# EAGLE design final v3 (EAGLE 7.7.0)
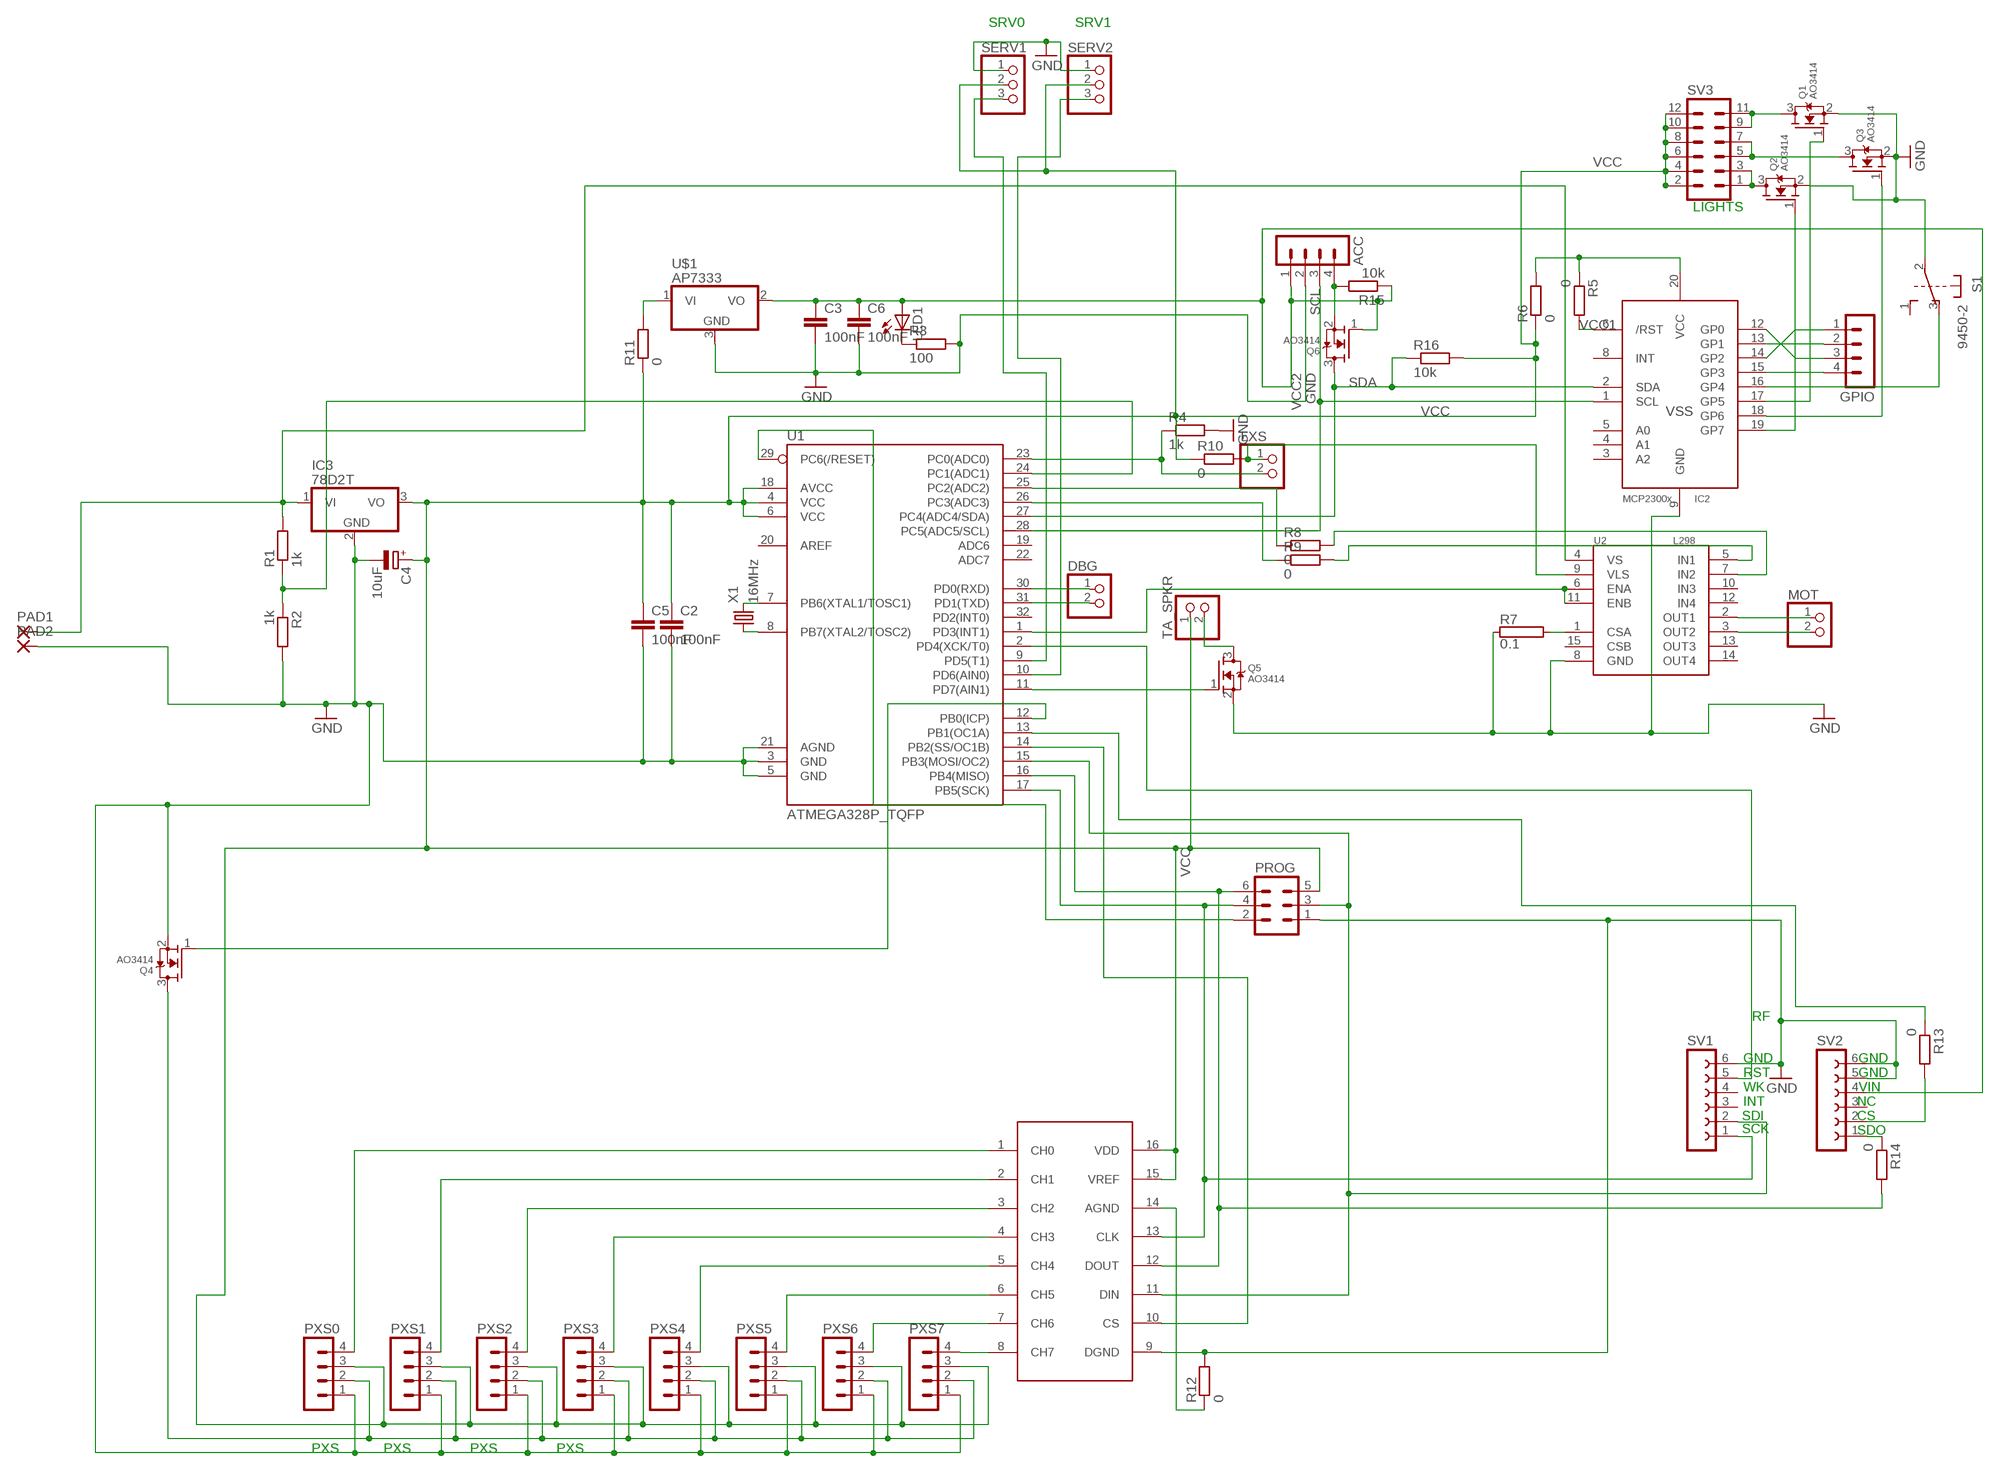
[diagram p0: schematic, sheet 1]

## Parts
ACC  MA04-1  [MA04-1]
C2  100nF  C-EUC1206  [C1206]
C3  100nF  C-EUC1206  [C1206]
C4  10uF  CPOL-EU153CLV-0505  [153CLV-0505]
C5  100nF  C-EUC1206  [C1206]
C6  100nF  C-EUC1206  [C1206]
DBG  PINHD-1X2  [1X02]
GPIO  MA04-1  [MA04-1]
IC2  MCP23008/SS  [SSOP20]
IC3  78D2T  [D2PACK]
LED1  LEDCHIPLED_0603  [CHIPLED_0603]
LXS  PINHD-1X2  [1X02]
MOT  PINHD-1X2  [1X02]
PAD1  SMD5  [SMD2,54-5,08]
PAD2  SMD5  [SMD2,54-5,08]
PROG  MA03-2  [MA03-2]
PXS0  MA04-1  [MA04-1]
PXS1  MA04-1  [MA04-1]
PXS2  MA04-1  [MA04-1]
PXS3  MA04-1  [MA04-1]
PXS4  MA04-1  [MA04-1]
PXS5  MA04-1  [MA04-1]
PXS6  MA04-1  [MA04-1]
PXS7  MA04-1  [MA04-1]
Q1  AO3414  MOSFET-NREFLOW  [SOT23]
Q2  AO3414  MOSFET-NREFLOW  [SOT23]
Q3  AO3414  MOSFET-NREFLOW  [SOT23]
Q4  AO3414  MOSFET-NREFLOW  [SOT23]
Q5  AO3414  MOSFET-NREFLOW  [SOT23]
Q6  AO3414  MOSFET-NREFLOW  [SOT23]
R1  1k  R-EU_M1206  [M1206]
R2  1k  R-EU_R1206  [R1206]
R3  100  R-EU_R0603  [R0603]
R4  1k  R-EU_M1206  [M1206]
R5  0  R-EU_R0805BR  [R0805BR]
R6  0  R-EU_R0805BR  [R0805BR]
R7  0.1  RKH208-8R  [KH208R-8]
R8  0  R-EU_R0805BR  [R0805BR]
R9  0  R-EU_R0805BR  [R0805BR]
R10  0  R-EU_R0805BR  [R0805BR]
R11  0  R-EU_R0805BR  [R0805BR]
R12  0  R-EU_R0805BR  [R0805BR]
R13  0  R-EU_R0805BR  [R0805BR]
R14  0  R-EU_R0805BR  [R0805BR]
R15  10k  R-EU_R0805BR  [R0805BR]
R16  10k  R-EU_R0805BR  [R0805BR]
S1  9450-2  [9450-2]
SERV1  PINHD-1X3  [1X03]
SERV2  PINHD-1X3  [1X03]
SV1  FE06-1  [FE06]
SV2  FE06-1  [FE06]
SV3  MA06-2  [MA06-2]
TA_SPKR  PINHD-1X2  [1X02]
U1  ATMEGA328P_TQFP  [TQFP32-08]
U2  L298  [MULTIWATT15]
U$1  AP7333  [SOT23]
U$3  MCP3208  [SO-16]
X1  16MHz  CRYSTALHC49S  [HC49/S]

## Nets
!RST: PROG.2 U1.29(PC6(/RESET))
GND: ACC.2 C2.2 C3.2 C4.- C5.2 C6.2 IC2.9(GND) IC3.2(GND) PAD2.1(P) PROG.1 PXS0.1 PXS1.1 PXS2.1 PXS3.1 PXS4.1 PXS5.1 PXS6.1 PXS7.1 Q1.2(S) Q2.2(S) Q3.2(S) Q4.2(S) Q5.2(S) R2.2 R3.2 R4.2 R7.1 R12.2 S1.2(1:P) SERV1.1 SERV2.1 SV1.6 SV2.5 SV2.6 U1.3(GND) U1.5(GND) U1.21(AGND) U2.8(GND) U$1.3(GND) U$3.9(DGND)
M_EN: U1.1(PD3(INT1)) U2.6(ENA) U2.11(ENB)
M_IN1: R8.2 U2.7(IN2)
M_IN2: R9.1 U1.26(PC3(ADC3))
MISO: PROG.6 R14.2 U1.16(PB4(MISO)) U$3.12(DOUT)
MOSI: PROG.3 SV1.2 U1.15(PB3(MOSI/OC2)) U$3.11(DIN)
N$1: Q5.1(G) U1.11(PD7(AIN1))
N$2: Q5.3(D) TA_SPKR.2
N$3: U1.14(PB2(SS/OC1B)) U$3.10(CS)
N$4: Q1.3(D) SV3.9 SV3.11
N$5: DBG.1 U1.30(PD0(RXD))
N$6: PXS7.4 U$3.8(CH7)
N$7: MOT.1 U2.2(OUT1)
N$8: PXS6.4 U$3.7(CH6)
N$9: PXS5.4 U$3.6(CH5)
N$10: DBG.2 U1.31(PD1(TXD))
N$11: PXS4.4 U$3.5(CH4)
N$12: PXS3.4 U$3.4(CH3)
N$13: PXS2.4 U$3.3(CH2)
N$14: PXS1.4 U$3.2(CH1)
N$15: Q3.3(D) SV3.5 SV3.7
N$16: PXS0.4 U$3.1(CH0)
N$17: Q2.3(D) SV3.1 SV3.3
N$18: LXS.2 R4.1 U1.23(PC0(ADC0))
N$19: Q4.1(G) U1.12(PB0(ICP))
N$20: PXS0.2 PXS1.2 PXS2.2 PXS3.2 PXS4.2 PXS5.2 PXS6.2 PXS7.2 Q4.3(D)
N$21: ACC.4 Q6.2(S) R15.2
N$22: MOT.2 U2.3(OUT2)
N$23: LED1.C R3.1
N$24: R8.1 U1.25(PC2(ADC2))
N$25: R9.2 U2.5(IN1)
N$26: SV1.5 U1.2(PD4(XCK/T0))
N$30: IC2.20(VCC) R5.1 R6.2
N$31: SERV1.3 U1.9(PD5(T1))
N$32: U1.7(PB6(XTAL1/TOSC1)) X1.2
N$33: IC2.19(GP7) Q2.1(G)
N$34: SERV2.3 U1.10(PD6(AIN0))
N$35: IC2.17(GP5) Q1.1(G)
N$36: IC2.18(GP6) Q3.1(G)
N$37: U1.8(PB7(XTAL2/TOSC2)) X1.1
N$38: R7.2 U2.1(CSA)
N$39: IC2.16(GP4) S1.3(1:O)
N$40: GPIO.3 IC2.12(GP0)
N$41: GPIO.2 IC2.13(GP1)
N$42: GPIO.1 IC2.14(GP2)
N$43: GPIO.4 IC2.15(GP3)
N$45: R11.2 U$1.1(VI)
N$46: R12.1 U$3.14(AGND)
N$47: R14.1 SV2.1
N$48: R13.2 SV2.2
RF_CS: R13.1 U1.13(PB1(OC1A))
SCK: PROG.4 SV1.1 U1.17(PB5(SCK)) U$3.13(CLK)
SCL: ACC.3 IC2.1(SCL) U1.28(PC5(ADC5/SCL))
SDA: IC2.2(SDA) Q6.3(D) R16.1 U1.27(PC4(ADC4/SDA))
VBATT: R1.1 R2.1 U1.24(PC1(ADC1))
VCC: C2.1 C4.+ C5.1 IC3.3(VO) PROG.5 PXS0.3 PXS1.3 PXS2.3 PXS3.3 PXS4.3 PXS5.3 PXS6.3 PXS7.3 R6.1 R10.1 R11.1 R16.2 SERV1.2 SERV2.2 SV3.2 SV3.4 SV3.6 SV3.8 SV3.10 SV3.12 TA_SPKR.1 U1.4(VCC) U1.6(VCC) U1.18(AVCC) U$3.15(VREF) U$3.16(VDD)
VCC0: LXS.1 R10.2 U2.9(VLS)
VCC1: IC2.6(/RST) R5.2
VCC2: ACC.1 C3.1 C6.1 LED1.A Q6.1(G) R15.1 SV2.4 U$1.2(VO)
VSS: IC3.1(VI) PAD1.1(P) R1.2 U2.4(VS)
Unconnected: IC2.3(A2) IC2.4(A1) IC2.5(A0) IC2.8(INT) S1.1(1:S) S1.4(2:S) S1.5(2:P) S1.6(2:O) SV1.3 SV1.4 SV2.3 U1.19(ADC6) U1.20(AREF) U1.22(ADC7) U1.32(PD2(INT0)) U2.10(IN3) U2.12(IN4) U2.13(OUT3) U2.14(OUT4) U2.15(CSB)

## Notes on the sheet
- SRV0 | SRV1
- LIGHTS
- RF
- GND | GND
- RST | GND
- WK | VIN
- INT | NC
- SDI | CS
- SCK | SDO
- PXS | PXS | PXS | PXS

## Library data of the parts
ACC GPIO = con-lstb:MA04-1: PIN HEADER; OC_FARNELL: unknown; OC_NEWARK: unknown
C2 C3 C5 C6 = rcl:C-EU: CAPACITOR, European symbol
C4 = rcl:CPOL-EU: POLARIZED CAPACITOR, European symbol
DBG LXS MOT TA_SPKR = pinhead:PINHD-1X2: PIN HEADER
IC2 = adafruit:MCP23008: MCP23008 Inexpensive i2c i/o expander - 8 general purpose i/o pins with optional pullups
IC3 = custom:78*: Positive VOLTAGE REGULATOR Source: http://cache.national.com/ds/LM/LM78L05.pdf http://www.fairchildsemi.com/ds/LM/LM7805.pdf
LED1 = led:LED: LED OSRAM: - CHIPLED LG R971, LG N971, LY N971, LG Q971, LY Q971, LO R971, LY R971 LH N974, LH R974 LS Q976, LO Q976, LY Q976 LO Q996 - Hyper CHIPLED LW Q18S LB Q993, LB Q99A, LB R99A - SideLED LS A670, LO A670, LY A670, LG A670, LP A670 LB A673, LV A673, LT A673, LW A673 LH A674 LY A675 LS A676, LA A676, LO A676, LY A676, LW A676 LS A679, LY A679, LG A679 - Hyper Micro SIDELED® LS Y876, LA Y876, LO Y876, LY Y876 LT Y87S - SmartLED LW L88C, LW L88S LB L89C, LB L89S, LG L890 LS L89K, LO L89K, LY L89K LS L896, LA L896, LO L896, LY L896 - TOPLED LS T670, LO T670, LY T670, LG T670, LP T670 LSG T670, LSP T670, LSY T670, LOP T670, LYG T670 LG T671, LOG T671, LSG T671 LB T673, LV T673, LT T673, LW T673 LH T674 LS T676, LA T676, LO T676, LY T676, LB T676, LH T676, LSB T676, LW T676 LB T67C, LV T67C, LT T67C, LS T67K, LO T67K, LY T67K, LW E67C LS E67B, LA E67B, LO E67B, LY E67B, LB E67C, LV E67C, LT E67C LW T67C LS T679, LY T679, LG T679 LS T770, LO T770, LY T770, LG T770, LP T770 LB T773, LV T773, LT T773, LW T773 LH T774 LS E675, LA E675, LY E675, LS T675 LS T776, LA T776, LO T776, LY T776, LB T776 LHGB T686 LT T68C, LB T68C - Hyper Mini TOPLED® LB M676 - Mini TOPLED Santana® LG M470 LS M47K, LO M47K, LY M47K Source: http://www.osram.convergy.de LUXEON: - LUMILED® LXK2-PW12-R00, LXK2-PW12-S00, LXK2-PW14-U00, LXK2-PW14-V00 LXK2-PM12-R00, LXK2-PM12-S00, LXK2-PM14-U00 LXK2-PE12-Q00, LXK2-PE12-R00, LXK2-PE12-S00, LXK2-PE14-T00, LXK2-PE14-U00 LXK2-PB12-K00, LXK2-PB12-L00, LXK2-PB12-M00, LXK2-PB14-N00, LXK2-PB14-P00, LXK2-PB14-Q00 LXK2-PR12-L00, LXK2-PR12-M00, LXK2-PR14-Q00, LXK2-PR14-R00 LXK2-PD12-Q00, LXK2-PD12-R00, LXK2-PD12-S00 LXK2-PH12-R00, LXK2-PH12-S00 LXK2-PL12-P00, LXK2-PL12-Q00, LXK2-PL12-R00 Source: www.luxeon.com KINGBRIGHT: KA-3528ASYC Source: www.kingbright.com
PAD1 PAD2 = wirepad:SMD5: SMD PAD
PROG = con-lstb:MA03-2: PIN HEADER; OC_FARNELL: unknown; OC_NEWARK: unknown
PXS0 PXS1-PXS7 = custom:MA04-1: PIN HEADER; OC_FARNELL: unknown; OC_NEWARK: unknown
Q1-Q6 = adafruit:MOSFET-N: N-Channel Mosfet 2N7002E - 60V 260mA SOT23 [Digikey: 2N7002ET1GOSTR-ND] - REEL BSH103 - 30V 850mA SOT23 [Digikey: 568-5013-1-ND]
R1-R4 = resistor:R-EU_: RESISTOR, European symbol
R5 R6 R8-R16 = custom:R-EU_: RESISTOR, European symbol
R7 = resistor-power:R: Power Resitor; OC_FARNELL: unknown; OC_NEWARK: unknown
S1 = custom:9450-2: MARQUARDT SWITCH
SERV1 SERV2 = pinhead:PINHD-1X3: PIN HEADER
SV1 SV2 = con-lsta:FE06-1: FEMALE HEADER; OC_FARNELL: unknown; OC_NEWARK: unknown
SV3 = con-lstb:MA06-2: PIN HEADER; OC_FARNELL: unknown; OC_NEWARK: unknown
U1 = SparkFun-IC-Microcontroller:ATMEGA328P_TQFP: Popular 328P in QFP Storefront component: ATmega328 - TQFP <https://www.sparkfun.com/products/13448> (COM-13448) Datasheet <http://www.sparkfun.com/datasheets/Components/SMD/ATMega328.pdf> SparkFun Products SparkFun RedBoard - Programmed with Arduino <https://www.sparkfun.com/products/12757> (DEV-12757) Arduino Pro Mini 328 - 5V/16MHz <https://www.sparkfun.com/products/11113> (DEV-11113) Arduino Pro Mini 328 - 3.3V/8MHz <https://www.sparkfun.com/products/11114> (DEV-11114) SparkFun OpenLog <https://www.sparkfun.com/products/13712> (DEV-13712) SparkFun MicroView - OLED Arduino Module <https://www.sparkfun.com/products/12923> (DEV-12923) SparkFun Digital Sandbox <https://www.sparkfun.com/products/12651> (DEV-12651) SparkFun PicoBoard <https://www.sparkfun.com/products/11888> (WIG-11888) Arduino Fio <https://www.sparkfun.com/products/10116> (DEV-10116) LilyPad Arduino 328 Main Board <https://www.sparkfun.com/products/13342> (DEV-13342) SparkFun RedStick <https://www.sparkfun.com/products/13741> (DEV-13741) LilyPad MP3 <https://www.sparkfun.com/products/11013> (DEV-11013) LilyPad Arduino SimpleSnap <https://www.sparkfun.com/products/10941> (DEV-10941) SparkFun Stepoko <https://www.sparkfun.com/products/13899> (ROB-13899) SparkFun Geiger Counter <https://www.sparkfun.com/products/11345> (SEN-11345) SparkFun EL Sequencer <https://www.sparkfun.com/products/12781> (COM-12781) Arduino Pro 328 - 5V/16MHz <https://www.sparkfun.com/products/10915> (DEV-10915) CryptoCape <https://www.sparkfun.com/products/12773> (DEV-12773) SparkFun IR Thermometer Evaluation Board - MLX90614 <https://www.sparkfun.com/products/10740> (SEN-10740) SparkFun RedBot Mainboard <https://www.sparkfun.com/products/12097> (ROB-12097) Arduino Pro 328 - 3.3V/8MHz <https://www.sparkfun.com/products/10914> (DEV-10914) SparkFun Block for Intel® Edison - Arduino <https://www.sparkfun.com/products/13036> (DEV-13036) SparkFun Simon Says - Surface Mount Soldering Kit <https://www.sparkfun.com/products/10935> (KIT-10935) SparkFun 7-Segment Serial Display - Red <https://www.sparkfun.com/products/11441> (COM-11441) SparkFun 7-Segment Serial Display - White <https://www.sparkfun.com/products/11629> (COM-11629) SparkFun 7-Segment Serial Display - Yellow <https://www.sparkfun.com/products/11443> (COM-11443) SparkFun 7-Segment Serial Display - Kelly Green <https://www.sparkfun.com/products/11440> (COM-11440) SparkFun 7-Segment Serial Display - Blue <https://www.sparkfun.com/products/11442> (COM-11442) SparkFun OpenSegment Serial Display - 20mm (Blue) <https://www.sparkfun.com/products/11647> (COM-11647) SparkFun OpenSegment Serial Display - 20mm (Green) <https://www.sparkfun.com/products/11646> (COM-11646) SparkFun OpenSegment Serial Display - 20mm (White) <https://www.sparkfun.com/products/11648> (COM-11648) SparkFun OpenSegment Serial Display - 20mm (Red) <https://www.sparkfun.com/products/11644> (COM-11644) SparkFun OpenSegment Serial Display - 20mm (Yellow) <https://www.sparkfun.com/products/11645> (COM-11645) SparkFun OpenSegment Shield <https://www.sparkfun.com/products/13190> (DEV-13190); PROD_ID: IC-09069
U2 = SparkFun-IC-Special-Function:L298: L298 Dual Full Bridge Driver
U$1 = custom:AP7333; PACKAGE: SOT23
U$3 = custom:MCP3208
X1 = adafruit:CRYSTAL: CRYSTAL; OC_FARNELL: 1667008; OC_NEWARK: unknown

## Board
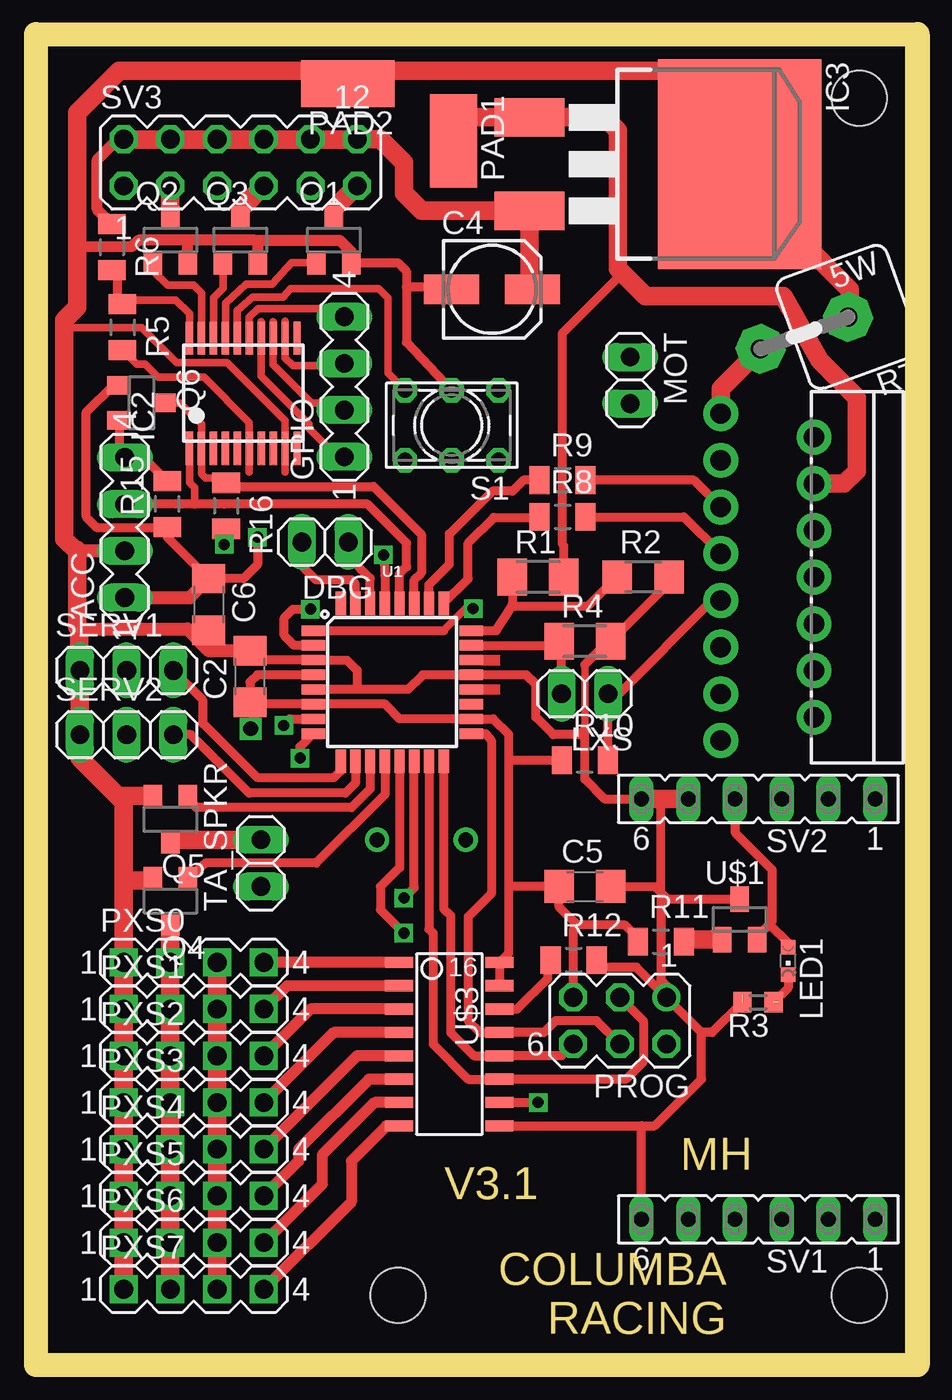
[diagram p1: board, top side]
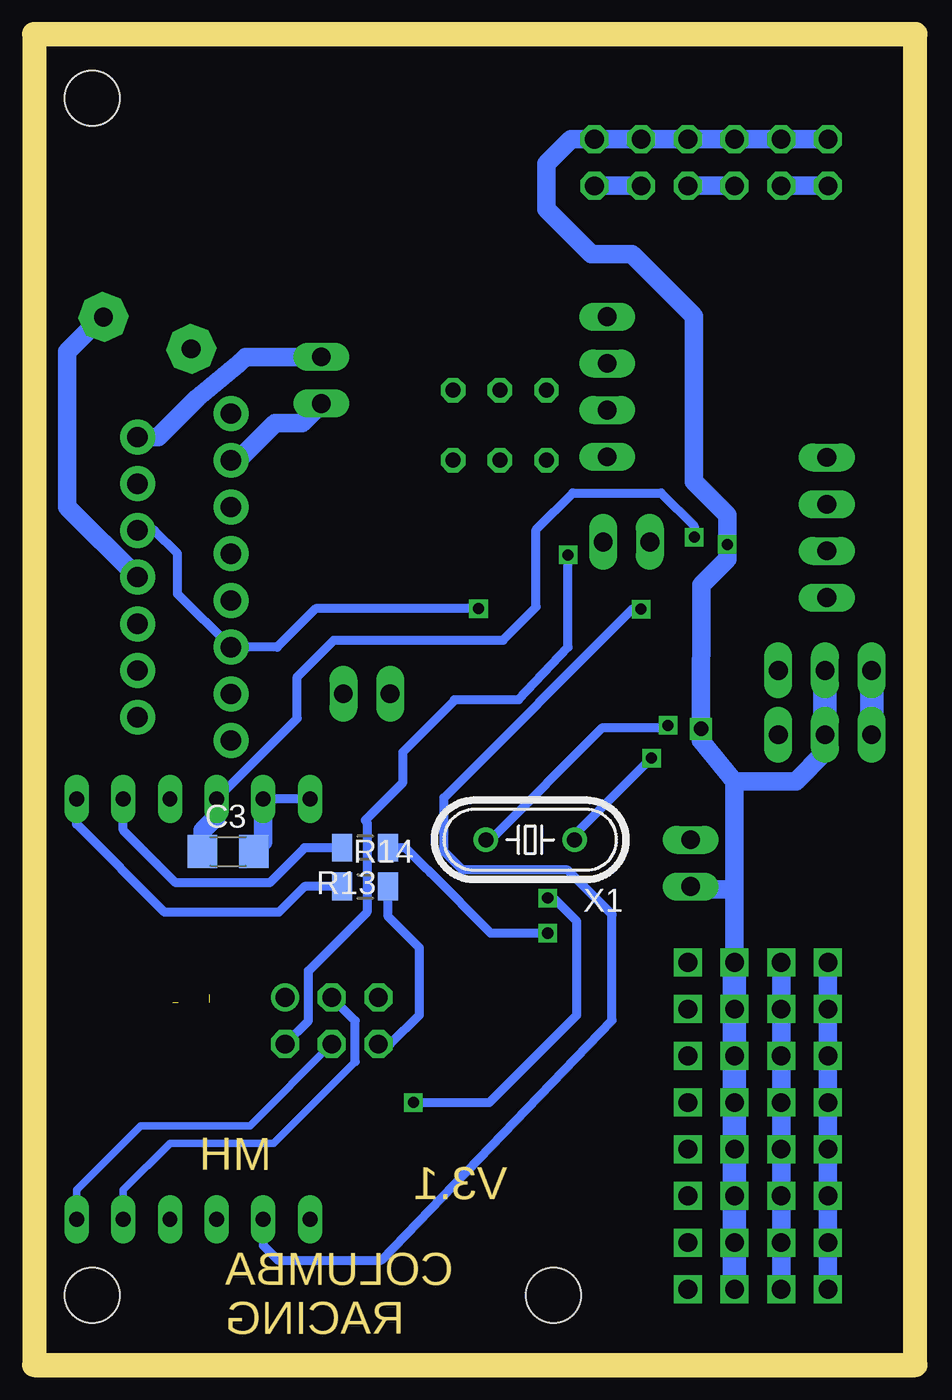
[diagram p2: board, bottom side, seen from below]

Size 46.66 x 71.11 mm. Coordinates in mm from the lower left corner, seen from the top.
Outline: 0,0 46.66,0 46.66,71.11 0,71.11
Copper layers (1*16): Top 0.035mm / dielectric 1.5mm / Bottom 0.035mm
Design rules "default *": minimum track width 10mil, minimum drill 24mil, track to track 0.15mm, track to pad 0.15mm, pad to pad 0.15mm, via to via 0.15mm, smd to smd 0.15mm, copper to edge 40mil, drill to drill 8mil, minimum pad ring 10mil, minimum via ring 8mil, stop-mask expansion 4mil, vias tented up to drill 0mil, thermal gap 10mil
Holes 3 mm at 44.13,68.26 44.13,3.17 19.05,3.17
Milling: 4 lines

### Footprints (pad centres in the part's own frame; a part is rotated, then mirrored left to right if it is on the bottom)
MA04-1 = drill 1.016 long: 1 -3.81,0; 2 -1.27,0; 3 1.27,0; 4 3.81,0
C1206 = smd 1.6 x 1.8: 1 -1.4,0; 2 1.4,0
153CLV-0505 = smd 3 x 1.6: + 2.2,0; - -2.2,0
1X02 = drill 1.016 long: 1 -1.27,0; 2 1.27,0
SSOP20 = smd 0.4 x 1.8: 1 -2.925,-3; 2 -2.275,-3; 3 -1.625,-3; 4 -0.975,-3; 5 -0.325,-3; 6 0.325,-3; 7 0.975,-3; 8 1.625,-3; 9 2.275,-3; 10 2.925,-3; 11 2.925,3; 12 2.275,3; 13 1.625,3; 14 0.975,3; 15 0.325,3; 16 -0.325,3; 17 -0.975,3; 18 -1.625,3; 19 -2.275,3; 20 -2.925,3
D2PACK = smd 2.083 x 3.81: 1 -2.54,-8.89; 3 2.54,-8.89 | smd 11.43 x 8.89: 2 0,2.54
CHIPLED_0603 = smd 0.8 x 0.8: A 0,-0.75; C 0,0.75
SMD2,54-5,08 = smd 2.54 x 5.08: 1 0,0
MA03-2 = drill 1.016: 1 -2.54,-1.27 | drill 1.016 octagon: 2 -2.54,1.27; 3 0,-1.27; 4 0,1.27; 5 2.54,-1.27; 6 2.54,1.27
MA04-1' = drill 1.016 square: 1 -3.81,0; 2 -1.27,0; 3 1.27,0; 4 3.81,0
SOT23 = smd 1 x 1.27: 1 -0.95,-1.227; 2 0.95,-1.227; 3 0,1.227
M1206 = smd 1.6 x 2: 1 -1.4,0; 2 1.4,0
R1206 = smd 1.6 x 1.803: 1 -1.422,0; 2 1.422,0
R0603 = smd 1 x 1.1: 1 -0.85,0; 2 0.85,0
R0805BR = smd 1.1 x 1.5: 1 -1.25,0; 2 1.25,0
KH208R-8 = drill 1.016 pad 2.54 octagon: 1 -2.54,0; 2 2.54,0
9450-2 = drill 0.813 octagon: 1 -2.54,-1.905; 2 0,-1.905; 3 2.54,-1.905; 4 -2.54,1.905; 5 0,1.905; 6 2.54,1.905
1X03 = drill 1.016 long: 1 -2.54,0; 2 0,0; 3 2.54,0
FE06 = drill 0.813 long: 1 -6.35,0; 2 -3.81,0; 3 -1.27,0; 4 1.27,0; 5 3.81,0; 6 6.35,0
MA06-2 = drill 1.016 octagon: 1 -6.35,-1.27; 2 -6.35,1.27; 3 -3.81,-1.27; 4 -3.81,1.27; 5 -1.27,-1.27; 6 -1.27,1.27; 7 1.27,-1.27; 8 1.27,1.27; 9 3.81,-1.27; 10 3.81,1.27; 11 6.35,-1.27; 12 6.35,1.27
TQFP32-08 = smd 1.27 x 0.559: 1 -4.293,2.8; 2 -4.293,2; 3 -4.293,1.2; 4 -4.293,0.4; 5 -4.293,-0.4; 6 -4.293,-1.2; 7 -4.293,-2; 8 -4.293,-2.8; 17 4.293,-2.8; 18 4.293,-2; 19 4.293,-1.2; 20 4.293,-0.4; 21 4.293,0.4; 22 4.293,1.2; 23 4.293,2; 24 4.293,2.8 | smd 0.559 x 1.27: 9 -2.8,-4.293; 10 -2,-4.293; 11 -1.2,-4.293; 12 -0.4,-4.293; 13 0.4,-4.293; 14 1.2,-4.293; 15 2,-4.293; 16 2.8,-4.293; 25 2.8,4.293; 26 2,4.293; 27 1.2,4.293; 28 0.4,4.293; 29 -0.4,4.293; 30 -1.2,4.293; 31 -2,4.293; 32 -2.8,4.293
MULTIWATT15 = drill 1.1 pad 1.9: 1 -8.95,-2.39; 2 -7.68,2.69; 3 -6.41,-2.39; 4 -5.14,2.69; 5 -3.87,-2.39; 6 -2.6,2.69; 7 -1.33,-2.39; 8 -0.06,2.69; 9 1.21,-2.39; 10 2.48,2.69; 11 3.75,-2.39; 12 5.02,2.69; 13 6.29,-2.39; 14 7.56,2.69; 15 8.83,-2.39
SOT23' = smd 1 x 1.4: 1 -0.95,-1.1; 2 0.95,-1.1; 3 0,1.1
SO-16 = smd 0.61 x 1.524: 1 -4.445,-2.794; 2 -3.175,-2.794; 3 -1.905,-2.794; 4 -0.635,-2.794; 5 0.635,-2.794; 6 1.905,-2.794; 7 3.175,-2.794; 8 4.445,-2.794; 9 4.445,2.667; 10 3.175,2.667; 11 1.905,2.667; 12 0.635,2.667; 13 -0.635,2.667; 14 -1.905,2.667; 15 -3.175,2.667; 16 -4.445,2.667
HC49/S = drill 0.813: 1 -2.413,0; 2 2.413,0

### Placement (x,y rotation side)
ACC  4.19,44.92 90 top
C2  11,36.83 90 top
C3  36.74,27.3 0 bottom
C4  24.17,57.88 0 top
C5  29.21,25.4 0 top
C6  8.76,40.74 270 top
DBG  15.08,44.13 180 top
GPIO  16.13,52.58 90 top
IC2  10.64,52.23 0 top
IC3  35.08,64.68 270 top
LED1  40.27,21.35 180 top
LXS  29.21,35.88 180 top
MOT  31.68,52.93 270 top
PAD1  22.07,65.95 180 top
PAD2  16.33,69.06 90 top
PROG  31.11,18.1 180 top
PXS0  [MA04-1']  7.94,21.27 0 top
PXS1  [MA04-1']  7.94,18.73 0 top
PXS2  [MA04-1']  7.94,16.19 0 top
PXS3  [MA04-1']  7.94,13.65 0 top
PXS4  [MA04-1']  7.94,11.11 0 top
PXS5  [MA04-1']  7.94,8.57 0 top
PXS6  [MA04-1']  7.94,6.03 0 top
PXS7  [MA04-1']  7.94,3.49 0 top
Q1  15.56,60.55 0 top
Q2  6.67,60.55 0 top
Q3  10.48,60.55 0 top
Q4  6.67,24.61 180 top
Q5  6.67,29.05 180 top
Q6  5.1,51.7 270 top
R1  26.67,42.23 0 top
R2  32.38,42.23 0 top
R3  38.63,19.11 180 top
R4  29.21,38.73 0 top
R5  4.06,55.81 270 top
R6  3.49,60.17 270 top
R7  41.15,55.5 200 top
R8  28,45.5 0 top
R9  28,47.5 0 top
R10  29.21,32.26 0 top
R11  33.35,22.4 0 top
R12  28.6,21.4 0 top
R13  29.3,27.5 180 bottom
R14  29.3,25.4 0 bottom
R15  6.5,46.2 90 top
R16  9.7,46.1 270 top
S1  21.97,50.48 180 top
SERV1  4.29,37.15 0 top
SERV2  4.29,33.66 0 top
SV1  38.65,7.3 180 top
SV2  38.65,30.16 180 top
SV3  10.48,64.77 0 top
TA_SPKR  11.59,26.67 90 top
U1  18.73,36.51 0 top
U2  38.99,42.16 270 top
U$1  AP7333  [SOT23']  37.63,23.6 0 top
U$3  21.91,16.83 270 top
X1  20.32,27.94 180 bottom

### Tracks (layer width: path | path; a pad name or v marks a point on that pad's centre or on a via)
!RST  (via drill 0.6)
  Top 0.5: v18.26,43.43 18.33,42.31 U1.29
  Bottom 0.5: PROG.2 32.38,18.1 32.38,20.82 29.2,24 29.2,28.9 29.3,29 27.24,31.06 27.24,32.7 24.38,35.56 | v18.26,43.43 18.26,38.42 20.95,35.56 24.38,35.56 | 24.45,35.56 24.38,35.56
GND  (via drill 0.6)  (1 unrouted)
  Top 0.4: 29.21,37.47 29.21,33.97 | IC2.9 12.91,50.75 9.76,53.9 7,53.9 5.1,55.8 0.9,55.8
  Top 0.5: U$3.9 32.3,12.38 | 32.3,12.38 33.02,12.38 35.56,14.92 35.56,17.46 | 35.56,17.46 PROG.1 | PROG.1 32.02,21 30.25,21 R12.2 | 16.83,36.11 19.6,36.11 20.4,36.91 U1.21 26.02,36.91 26.54,36.39 26.54,34.61 27.5,33.66 28.89,33.66 29.21,33.97 29.21,31.24 30.29,30.16 SV2.6 | 16.83,36.11 U1.5 | 16.83,36.11 16.83,37.15 16.26,37.71 U1.3 10.68,37.71 C2.2 | 29.21,37.47 30.48,38.73 R4.2 33.81,41.93 R2.2 | 33.34,25.08 33.34,20.32 33.66,20 PROG.1 | SV1.6 32.3,12.38 | C5.2 33.02,25.4 33.34,25.08 | 33.34,25.08 33.34,29.82 33,30.16 | Q1.2 19.04,59.32 19.5,58.86 19.5,58 | 19.5,58 19.5,55 S1.2 | C4.- 21.85,58 19.5,58 | R3.2 36.13,17.46 35.56,17.46 | U$1.3 33.72,24.7 33.34,25.08
  Top 0.6: 11.27,60.55 15.88,60.55 16.51,59.91 Q1.2 | Q3.2 11.43,60.39 11.27,60.55 | 11.27,60.55 7.62,60.55 | 7.62,60.55 4.92,60.55 4.57,60.2 1.59,60.17 | Q2.2 7.62,60.55
  Top 0.7: 8.7,38.3 7.59,39.41 1.71,39.41 1.7,39.4 | 8.7,38.3 8.77,38.23 C2.2 | C6.2 8.7,39.29 8.7,38.3 | ACC.2 1.64,43.65 1.59,43.7
  Top 1: SV2.6 33,30.16 SV2.5 | 1.59,43.7 1.59,43.61 | 1.59,43.61 1.59,39.51 1.7,39.4 1.7,37.19 SERV1.1 SERV2.1 1.75,32.38 4.13,30 | 4.13,30 4.13,30.32 5.55,30.32 Q5.2 | 4.13,30 4.13,25.72 | 4.13,25.72 PXS0.1 PXS1.1 PXS2.1 PXS3.1 PXS4.1 PXS5.1 PXS6.1 PXS7.1 | Q4.2 5.71,25.72 4.13,25.72 | 16.4,69.76 34.43,69.76 37.62,66.57 IC3.2 37.5,64.56 37.5,64 43.63,57.87 v43.63,56.37 R7.1 | 16.4,69.76 3.88,69.76 1.59,67.47 1.59,60.17 1.59,56.9 0.9,56.21 0.9,55.8 0.9,44.3 1.59,43.61 | PAD2.1 16.33,69.69 16.4,69.76
  Bottom 0.5: SV2.6 SV2.5
  Bottom 1: PXS7.1 PXS0.1 | C3.2 34.84,27.81 SV2.5 | U2.8 45.5,46.05 45.5,54.5 v43.63,56.37
  Bottom 1.27: SERV1.1 SERV2.1
M_EN  (via drill 0.6)
  Top 0.4: 21.53,39.31 22.8,40.6 23.05,40.6 v23.13,40.51
  Top 0.5: U1.1 21.53,39.31
  Bottom 0.5: v23.13,40.51 31.99,40.51 34.09,38.41 U2.11 39.5,41.31 39.5,43.5 40.76,44.76 U2.6
M_IN1
  Top 0.5: R8.2 34.59,45.5 U2.7
M_IN2
  Top 0.5: U1.26 20.73,41.81 21.84,42.93 21.84,44.58 24.2,46.9 25.27,46.9 25.87,47.5 R9.1
MISO
  Top 0.5: U1.16 21.53,24.19 21.91,23.81 21.91,17.46 23.18,16.19 U$3.12 27.94,16.19 PROG.6
  Bottom 0.5: PROG.6 27.94,16.83 26.35,18.41 26.35,22.07 28.05,23.77 R14.2
MOSI
  Top 0.5: U1.15 20.73,23.08 20.95,22.86 20.95,16.83 22.86,14.92 U$3.11 31.43,14.92 32.38,15.88 32.38,18.1 PROG.3
  Bottom 0.406: 29.84,15.88 34.29,11.43 39.92,11.43 42.46,8.89 SV1.2
  Bottom 0.5: 29.84,15.88 29.84,18.1 PROG.3
N$1
  Top 0.5: U1.11 17.53,30.71 16.51,29.69 8.08,29.69 Q5.1
N$2
  Top 1: Q5.3 6.68,27.94 TA_SPKR.2
N$3  (via drill 0.6)
  Top 0.5: U$3.10 v26.67,13.65 | v19.37,24.77 19.93,25.33 U1.14
  Bottom 0.5: v26.67,13.65 22.54,13.65 17.78,18.41 17.78,23.5 19.05,24.77 v19.37,24.77
N$4
  Top 1: Q1.3 15.56,62.23 SV3.11
  Bottom 1: SV3.9 SV3.11
N$5
  Top 0.5: U1.30 17.53,42.16 16.35,43.34 DBG.1
N$6
  Top 0.6: U$3.8 18.41,12.38 16.51,10.48 16.51,8.26 PXS7.4
N$7
  Bottom 1: U2.2 40.56,49.84 38.4,52 36.2,53.8 35.8,54.2 MOT.1
N$8
  Top 0.6: U$3.7 17.78,13.65 14.92,10.79 14.92,9.21 PXS6.4
N$9
  Top 0.6: U$3.6 17.46,14.92 13.65,11.11 13.65,10.48 PXS5.4
N$10
  Top 0.5: U1.31 16.73,41.85 16.51,42.07 14.61,42.07 13.81,42.86 DBG.2
N$11
  Top 0.6: U$3.5 16.83,16.19 PXS4.4
N$12
  Top 0.6: U$3.4 15.56,17.46 PXS3.4
N$13
  Top 0.6: U$3.3 14.29,18.73 PXS2.4
N$14
  Top 0.6: U$3.2 13.02,20 PXS1.4
N$15
  Top 1: Q3.3 10.48,62.23 SV3.7
  Bottom 1: SV3.5 SV3.7
N$16
  Top 0.6: U$3.1 PXS0.4
N$17
  Top 1: Q2.3 SV3.3
  Bottom 1: SV3.1 SV3.3
N$18
  Top 0.5: LXS.2 27.94,38.6 R4.1 | 27.49,39.05 R4.1 | U1.23 27.59,38.51 R4.1
N$19
  Top 0.5: U1.12 18.33,30.4 14.61,26.67 8.58,26.67 Q4.1
N$20
  Top 1: PXS0.2 Q4.3 | PXS0.2 PXS1.2 PXS2.2 PXS3.2 PXS4.2 PXS5.2 PXS6.2 PXS7.2 | PXS0.2 6.67,18.87 6.6,18.8
  Bottom 1: PXS0.2 PXS7.2
N$21
  Top 0.5: R15.2 5.22,48.73 ACC.4 3.87,49.04 Q6.2
N$22
  Bottom 1: U2.3 36.23,48.57 34.2,50.6 32.74,50.6 MOT.2
N$23  (1 unrouted)
  Top 0.5: LED1.C 40.27,19.9 R3.1
N$24
  Top 0.5: U1.25 22.86,42.13 22.86,44.07 24.26,45.47 26.72,45.47 R8.1
N$25
  Top 0.5: U2.5 35.13,47.5 R9.2
N$26  (via drill 0.6)
  Top 0.5: U1.2 13.4,38.51 12.86,39.05 12.86,40.01 13.34,40.48 v14.29,40.48
  Bottom 0.5: v14.29,40.48 14.76,40.48 25.02,30.23 25.02,27.3 24,26.29 18.29,26.29 15.88,23.88 15.88,18.13 28.42,5.08 34.04,5.08 34.84,5.87 SV1.5
N$27
  Top 0.4: 10.96,49.05 10.96,47.94
N$29
  Top 0.4: 12.91,48.9 12.91,47.94
N$30
  Top 0.4: 7.71,54.7 IC2.20 7.71,56.55 6.96,57.3 4.7,57.3 4.46,57.06 R5.1
  Top 0.5: 3.3,58.73 R6.2 3.49,58.81 3.8,58.5 3.8,57.33 R5.1
N$31
  Top 0.5: SERV1.3 8.41,35.56 8.41,34.29 11.37,31.33 15.58,31.33 15.93,31.68 U1.9
N$32  (via drill 0.6)
  Top 0.5: v12.83,34.16 13.18,34.51 U1.7
  Bottom 0.5: X1.2 22.48,27.94 16.38,34.04 12.95,34.04 v12.83,34.16
N$33
  Top 0.4: IC2.19 8.36,57.68 7.94,58.1 6.51,58.1 5.71,58.9 Q2.1
N$34
  Top 0.5: U1.10 16.73,31.02 16.19,30.48 10.95,30.48 7.78,33.66 SERV2.3
N$35
  Top 0.4: IC2.17 9.66,57.13 10.79,58.16 12.19,58.16 13.25,59.32 Q1.1
N$36
  Top 0.4: IC2.18 9.01,57.43 9.53,57.94 Q3.1
N$37  (via drill 0.6)
  Top 0.5: v13.72,32.38 13.72,32.99 U1.8
  Bottom 0.5: X1.1 17.91,28.19 v13.72,32.38
N$38
  Top 1: U2.1 36.6,52.47 R7.2
N$39
  Top 0.4: IC2.16 10.31,56.72 11.15,57.46 12.8,57.46 13.2,57.9 18,57.9 18.5,57.4 18.5,53.32 S1.3
N$40
  Top 0.4: GPIO.3 16,53.72 13.34,53.72 12.91,54.15 IC2.12 12.91,56.15
N$41
  Top 0.4: GPIO.2 15.75,51.31 15.37,51.69 14.35,51.69 12.26,53.78 IC2.13 12.26,56.13
N$42
  Top 0.4: GPIO.1 15.75,48.77 14.22,50.29 14.22,50.55 11.61,53.16 IC2.14 11.61,56.12
N$43
  Top 0.4: IC2.15 10.96,56.35 11.43,56.82 15.29,56.82 GPIO.4
N$44
  Top 1: 4,66 17,66
N$45
  Top 0.5: 34.72,22.52 R11.2
  Top 1: 34.72,22.52 36.67,22.52 U$1.1
N$46
  Top 0.5: U$3.14 25.53,18.73 27.2,20.4 27.2,20.9 27.35,21.05 R12.1
N$47
  Bottom 0.5: R14.1 32.6,25.4 34,24 40.2,24 45,28.8 SV2.1
N$48
  Bottom 0.5: R13.2 32.6,27.5 34.5,25.6 39.6,25.6 42.46,28.46 SV2.2
RF_CS  (via drill 0.6)
  Top 0.5: U1.13 19.13,26.43 18.1,25.4 18.1,24.13 v19.37,22.86
  Bottom 0.5: R13.1 27.1,27.5 26.1,26.5 25.75,26.15 22.46,22.86 v19.37,22.86
SCK
  Top 0.5: U1.17 23.81,33.71 24.13,33.34 24.13,25.02 22.86,23.75 22.86,18.1 23.5,17.46 U$3.13 26.99,17.46 27.62,18.1 29.84,18.1 PROG.4
  Bottom 0.406: PROG.4 35.56,12.38 41.51,12.38 45,8.89 SV1.1 45,6.67
SCL
  Top 0.4: IC2.1 7.71,47.38 8,47.09 8,46.19 | 8.9,46.19 9.6,46.19
  Top 0.5: U1.28 19.13,42.41 19.53,42.8 19.53,44.07 17.41,46.19 9.6,46.19 8,46.19 ACC.3
SDA
  Top 0.4: Q6.3 7.2,51.7 8.36,50.53 IC2.2 8.36,47.84 8.6,47.6 9.1,47.6 9.35,47.35 R16.1
  Top 0.5: U1.27 19.93,42.06 20.32,42.45 20.32,44.55 17.72,47.15 9.9,47.15 R16.1
VBATT
  Top 0.5: R2.1 29.38,40.64 25.4,40.64 | U1.24 24.39,39.31 25.25,40.64 25.4,40.64 | R1.1 25.27,40.77 25.4,40.64
VCC  (via drill 0.6, 0.8)
  Top 0.5: 25.08,25.4 25.08,21.78 U$3.16 U$3.15 | 25.08,25.4 25.08,32.26 | 25.08,32.26 25.08,33.66 24.23,34.51 U1.18 19.14,34.51 18.34,35.31 U1.6 11.27,35.31 | 11.27,35.31 10.91,35.31 C2.1 11,36.51 11.4,36.91 U1.4 | 25.08,25.4 C5.1 27.81,24.29 28.8,23.3 | v11.03,33.97 11.43,35.15 11.27,35.31 | R10.1 25.08,32.26 | 32,22.3 R11.1 | PROG.5 28.6,19.39 28.6,23.1 28.8,23.3 | 31.93,22.23 32,22.3 | 32,22.3 32,22.7 31.4,23.3 28.8,23.3 | R16.2 9.6,44.75 v9.6,44
  Top 0.6: R6.1 2.7,62.21 2.7,64.93 3.81,66.04 SV3.2
  Top 1: PXS7.3 PXS0.3 | 17.3,66.04 SV3.12 18.1,66.04 19.37,64.77 19.37,63.09 20.32,62.14 IC3.3 26.19,58.05 C4.+
  Bottom 1: 9.21,31.11 5.87,31.11 4.29,32.7 SERV2.2 | PXS0.3 9.21,25.24 | 9.21,25.24 9.21,31.11 | 9.21,31.11 11.03,33.34 v11.03,33.97 11,41.8 9.6,43.2 v9.6,44 9.6,45.6 11.43,47.43 11.43,56.43 14.8,59.8 17,59.8 19.43,62.23 19.43,64.71 18.1,66.04 SV3.12 SV3.10 SV3.8 SV3.6 SV3.4 SV3.2 | TA_SPKR.1 11.43,25.24 9.21,25.24
  Bottom 1.27: PXS7.3 PXS6.3 PXS5.3 PXS4.3 PXS3.3 PXS2.3 PXS1.3 PXS0.3 | SERV1.2 SERV2.2
VCC0
  Top 0.5: R10.2 30.46,35.86 LXS.1 31.05,35.88 36.07,40.89 36.54,40.89 U2.9
VCC1
  Top 0.4: IC2.6 10.96,50.63 8.49,53.1 6,53.1 5.3,53.8 4.83,53.8 R5.2
VCC2  (via drill 0.6)
  Top 0.5: 9.14,42.15 C6.1 | C6.1 6.5,44.4 R15.1 6.55,44.9 2.7,44.9 2.1,45.5 2.1,51.2 3.55,52.65 Q6.1 | v11.4,44.4 11.4,42.9 10.64,42.15 C6.1 | U$1.2 38.58,22.68 39.25,23.35 | 39.25,23.35 39.4,23.5 39.4,26.3 37.4,28.3 37.4,30.14 SV2.4 | LED1.A 40.27,22.33 39.25,23.35
  Top 0.7: 8.52,41.91 C6.1 7.72,41.11 ACC.1
  Bottom 0.5: SV2.4 33,34.54 33,36.8 31,38.8 21.8,38.8 20,40.6 20,44.8 18,46.8 13.2,46.8 11.4,45 v11.4,44.4
  Bottom 1: C3.1 38.14,28.45 37.38,29.21 SV2.4
VSS
  Top 0.5: R1.2 28.07,43.93 28,44 28,55.5 31.25,58.75
  Top 1: PAD1.1 22.07,67.22 IC3.1 30.28,67.22 31,66.5 31,59 31.25,58.75 32.5,57.5 40,57.5 42,54 44,52 44,48 43.3,47.3 U2.4
(copper drawn outside any net)
  shapes: Top area x2

### Text on the board
Milling: MH | V3.1 | COLUMBA / RACING